# EAGLE design mainb (EAGLE 6.5.0)
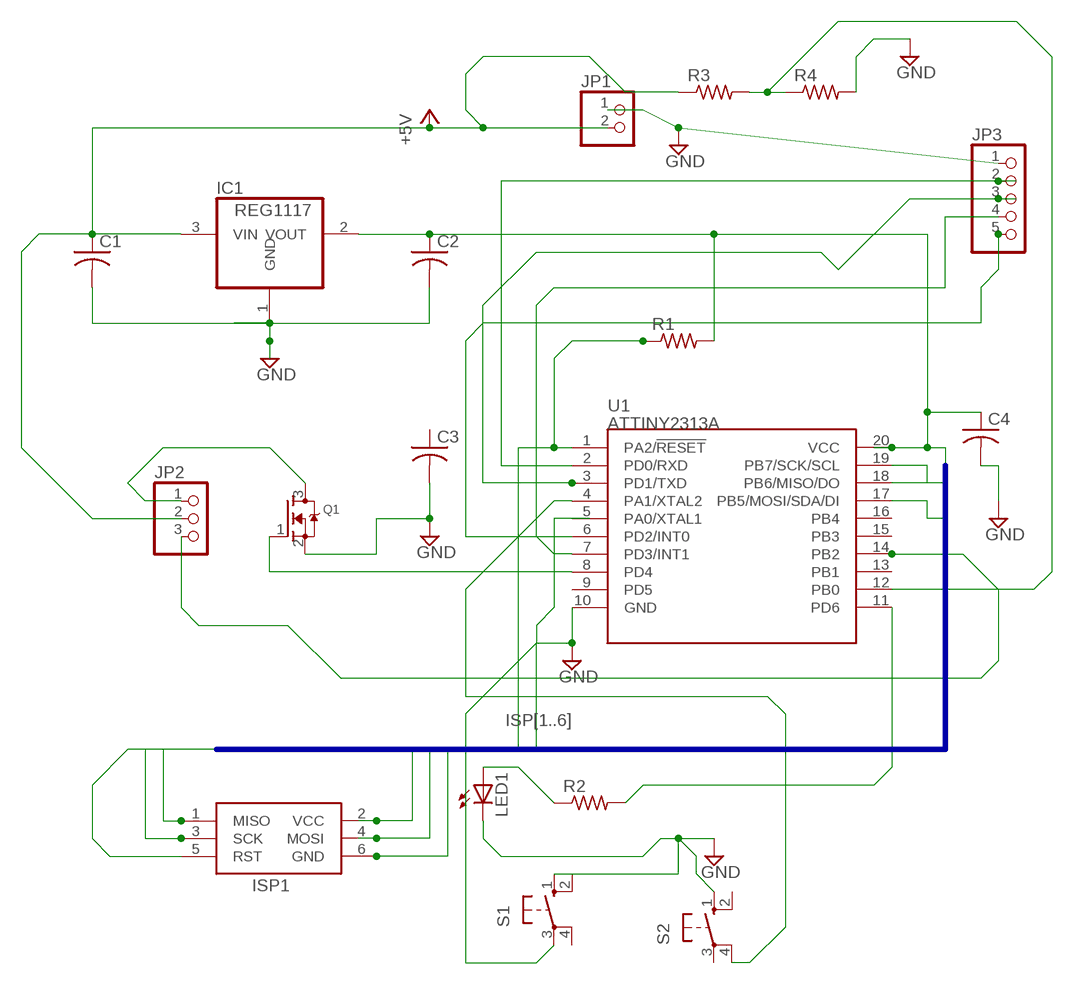
[diagram p0: schematic, sheet 1]

## Parts
C1  C-USC0603  [C0603]
C2  C-USC0603  [C0603]
C3  C-USC0603  [C0603]
C4  C-USC0603  [C0603]
IC1  REG1117  [SOT223]
ISP1  AVRISP-6  [AVRISP]
JP1  PINHD-1X2  [1X02]
JP2  PINHD-1X3  [1X03]
JP3  PINHD-1X5  [1X05]
LED1  LEDSML0603  [SML0603]
Q1  MOSFET-NREFLOW  [SOT23]
R1  R-US_R0603  [R0603]
R2  R-US_R0603  [R0603]
R3  R-US_R0603  [R0603]
R4  R-US_R0603  [R0603]
S1  10-XX  [B3F-10XX]
S2  10-XX  [B3F-10XX]
U1  ATTINY2313A  [SOP20W]

## Nets
+5V: C1.1 IC1.3(VIN) JP1.2 JP2.2 R3.1
GND: C1.2 C2.2 C3.2 C4.2 IC1.1(GND) JP1.1 JP3.1 LED1.C Q1.2(S) R4.2 S1.1(S) S2.1(S)
ISP1: ISP1.1(MISO) U1.18(PB6/MISO/DO)
ISP2: C2.1 C4.1 IC1.2(VOUT) ISP1.2(VCC) R1.2 U1.20(VCC)
ISP3: ISP1.3(SCK) U1.19(PB7/SCK/SCL)
ISP4: ISP1.4(MOSI) U1.17(PB5/MOSI/SDA/DI)
ISP5: ISP1.5(RST) R1.1 U1.1(PA2/!RESET)
ISP6: ISP1.6(GND) U1.10(GND) ; supply symbol labelled GND
N$1: JP2.1 Q1.3(D)
N$3: JP3.3 U1.3(PD1/TXD)
N$4: JP3.2 U1.2(PD0/RXD)
N$5: JP3.4 U1.7(PD3/INT1)
N$6: JP3.5 U1.6(PD2/INT0)
N$7: JP2.3 U1.14(PB2)
N$8: Q1.1(G) U1.8(PD4)
N$10: R3.2 R4.1 U1.12(PB0)
N$11: R2.2 U1.11(PD6)
N$12: LED1.A R2.1
N$13: S1.3(P) U1.5(PA0/XTAL1)
N$14: S2.4(P1) U1.4(PA1/XTAL2)
Unconnected: C3.1 S1.2(S1) S1.4(P1) S2.2(S1) S2.3(P) U1.9(PD5) U1.13(PB1) U1.15(PB3) U1.16(PB4)

## Buses
ISP[1..6]

## Library data of the parts
C1-C4 = adafruit:C-US: CAPACITOR, American symbol
IC1 = burr-brown:REG1117: 800mA and 1A Low Dropout (LDO) Positive Regulator 1.8V, 2.5V, 2.85V, 3.3V, 5V, and Adj; MPN: REG1117; OC_FARNELL: 1097566; OC_NEWARK: 14P6981
ISP1 = adafruit:AVRISP: AVR ISP HEADER Standard 6 pin header for AVR programming
JP1 = pinhead:PINHD-1X2: PIN HEADER
JP2 = adafruit:PINHD-1X3: PIN HEADER
JP3 = pinhead:PINHD-1X5: PIN HEADER
LED1 = led:LED: LED OSRAM: - CHIPLED LG R971, LG N971, LY N971, LG Q971, LY Q971, LO R971, LY R971 LH N974, LH R974 LS Q976, LO Q976, LY Q976 LO Q996 - Hyper CHIPLED LW Q18S LB Q993, LB Q99A, LB R99A - SideLED LS A670, LO A670, LY A670, LG A670, LP A670 LB A673, LV A673, LT A673, LW A673 LH A674 LY A675 LS A676, LA A676, LO A676, LY A676, LW A676 LS A679, LY A679, LG A679 - Hyper Micro SIDELED® LS Y876, LA Y876, LO Y876, LY Y876 LT Y87S - SmartLED LW L88C, LW L88S LB L89C, LB L89S, LG L890 LS L89K, LO L89K, LY L89K LS L896, LA L896, LO L896, LY L896 - TOPLED LS T670, LO T670, LY T670, LG T670, LP T670 LSG T670, LSP T670, LSY T670, LOP T670, LYG T670 LG T671, LOG T671, LSG T671 LB T673, LV T673, LT T673, LW T673 LH T674 LS T676, LA T676, LO T676, LY T676, LB T676, LH T676, LSB T676, LW T676 LB T67C, LV T67C, LT T67C, LS T67K, LO T67K, LY T67K, LW E67C LS E67B, LA E67B, LO E67B, LY E67B, LB E67C, LV E67C, LT E67C LW T67C LS T679, LY T679, LG T679 LS T770, LO T770, LY T770, LG T770, LP T770 LB T773, LV T773, LT T773, LW T773 LH T774 LS E675, LA E675, LY E675, LS T675 LS T776, LA T776, LO T776, LY T776, LB T776 LHGB T686 LT T68C, LB T68C - Hyper Mini TOPLED® LB M676 - Mini TOPLED Santana® LG M470 LS M47K, LO M47K, LY M47K Source: http://www.osram.convergy.de LUXEON: - LUMILED® LXK2-PW12-R00, LXK2-PW12-S00, LXK2-PW14-U00, LXK2-PW14-V00 LXK2-PM12-R00, LXK2-PM12-S00, LXK2-PM14-U00 LXK2-PE12-Q00, LXK2-PE12-R00, LXK2-PE12-S00, LXK2-PE14-T00, LXK2-PE14-U00 LXK2-PB12-K00, LXK2-PB12-L00, LXK2-PB12-M00, LXK2-PB14-N00, LXK2-PB14-P00, LXK2-PB14-Q00 LXK2-PR12-L00, LXK2-PR12-M00, LXK2-PR14-Q00, LXK2-PR14-R00 LXK2-PD12-Q00, LXK2-PD12-R00, LXK2-PD12-S00 LXK2-PH12-R00, LXK2-PH12-S00 LXK2-PL12-P00, LXK2-PL12-Q00, LXK2-PL12-R00 Source: www.luxeon.com KINGBRIGHT: KA-3528ASYC Source: www.kingbright.com
Q1 = adafruit:MOSFET-N: N-Channel Mosfet 2N7002E - 60V 260mA SOT23 [Digikey: 2N7002ET1GOSTR-ND] - REEL BSH103 - 30V 850mA SOT23 [Digikey: 568-5013-1-ND]
R1 R2 = resistor:R-US_: RESISTOR, American symbol
R3 R4 = adafruit:R-US_: RESISTOR, American symbol
S1 S2 = switch-omron:10-XX: OMRON SWITCH; MPN: B3F-1000; OC_FARNELL: 176432; OC_NEWARK: 36M3542
U1 = SparkFun-DigitalIC:ATTINY2313A: ATTINY2313A 2kB 20MHz I2C/SPI/UART; PROD_ID: IC-11305

## Board
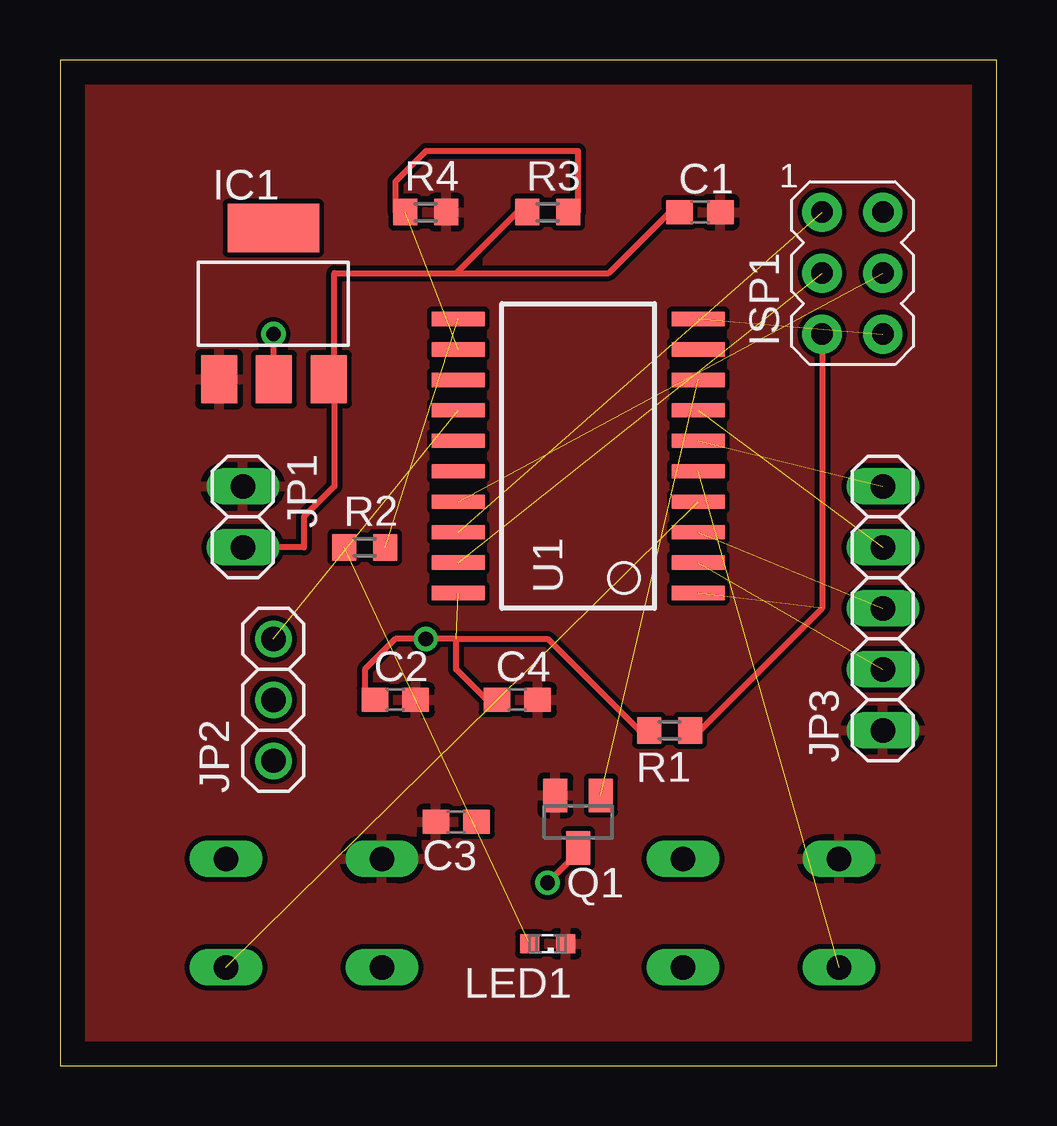
[diagram p1: board, top side]
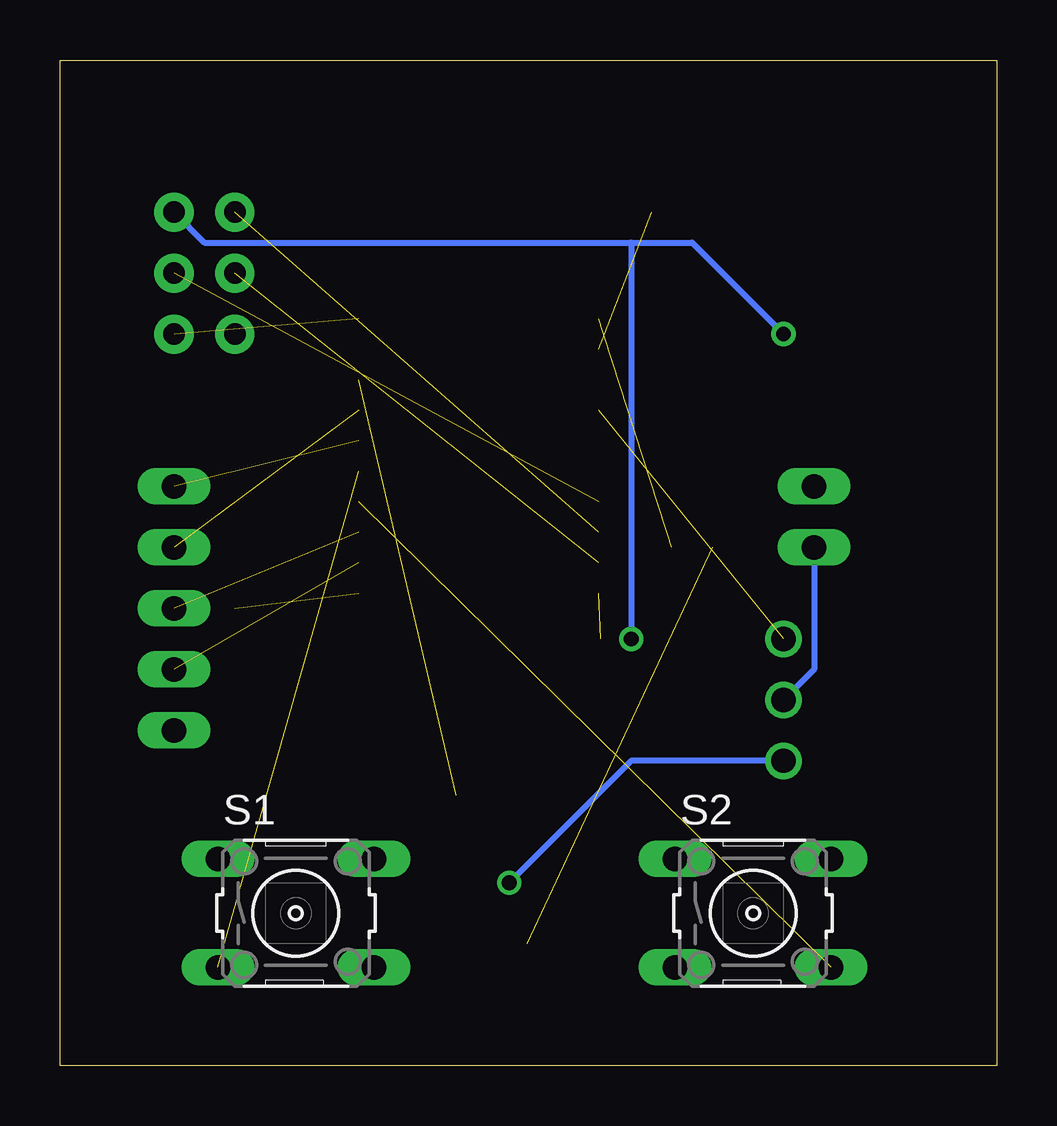
[diagram p2: board, bottom side, seen from below]

Size 39.04 x 41.9 mm. Coordinates in mm from the lower left corner, seen from the top.
Outline: 0,0 39.04,0 39.04,41.9 0,41.9 0,0
Copper layers (1*16): Top 0.035mm / dielectric 1.5mm / Bottom 0.035mm
Design rules "default": minimum track width 10mil, minimum drill 24mil, track to track 8mil, track to pad 8mil, pad to pad 8mil, via to via 8mil, smd to smd 8mil, copper to edge 40mil, drill to drill 8mil, minimum pad ring 10mil, minimum via ring 8mil, stop-mask expansion 4mil, vias tented up to drill 0mil, thermal gap 10mil

### Footprints (pad centres in the part's own frame; a part is rotated, then mirrored left to right if it is on the bottom)
C0603 = smd 1.1 x 1: 1 -0.85,0; 2 0.85,0
SOT223 = smd 1.499 x 2.007: 1 -2.261,-3.15; 2 0.025,-3.15; 3 2.311,-3.15 | smd 3.81 x 2.007: 4 0,3.15
AVRISP = drill 0.9 pad 1.626: 1 -1.27,2.54; 2 1.27,2.54; 3 -1.27,0; 4 1.27,0; 5 -1.27,-2.54; 6 1.27,-2.54
1X02 = drill 1.016 long: 1 -1.27,0; 2 1.27,0
1X03 = drill 1.016: 1 -2.54,0; 2 0,0; 3 2.54,0
1X05 = drill 1.016 long: 1 -5.08,0; 2 -2.54,0; 3 0,0; 4 2.54,0; 5 5.08,0
SML0603 = smd 0.8 x 0.8: A 0.75,0; C -0.75,0
SOT23 = smd 1 x 1.4: 1 -0.95,-1.1; 2 0.95,-1.1; 3 0,1.1
R0603 = smd 1 x 1.1: 1 -0.85,0; 2 0.85,0
B3F-10XX = drill 1.016 long: 1 -3.251,2.261; 2 3.251,2.261; 3 -3.251,-2.261; 4 3.251,-2.261
SOP20W = smd 0.6 x 2.2: 1 -5.715,-5; 2 -4.445,-5; 3 -3.175,-5; 4 -1.905,-5; 5 -0.635,-5; 6 0.635,-5; 7 1.905,-5; 8 3.175,-5; 9 4.445,-5; 10 5.715,-5; 11 5.715,5; 12 4.445,5; 13 3.175,5; 14 1.905,5; 15 0.635,5; 16 -0.635,5; 17 -1.905,5; 18 -3.175,5; 19 -4.445,5; 20 -5.715,5

### Placement (x,y rotation side)
C1  26.67,35.56 0 top
C2  13.97,15.24 0 top
C3  16.51,10.16 180 top
C4  19.05,15.24 0 top
IC1  8.89,31.75 0 top
ISP1  33.02,33.02 0 top
JP1  7.62,22.86 270 top
JP2  8.89,15.24 90 top
JP3  34.29,19.05 90 top
LED1  20.32,5.08 180 top
Q1  21.59,10.16 180 top
R1  25.4,13.97 180 top
R2  12.7,21.59 0 top
R3  20.32,35.56 0 top
R4  15.24,35.56 0 top
S1  29.21,6.35 0 bottom
S2  10.16,6.35 0 bottom
U1  21.59,25.4 90 top

### Tracks (layer width: path | path; a pad name or v marks a point on that pad's centre or on a via)
+5V
  Top 0.254: 16.51,33.02 19.05,35.56 R3.1 | 16.51,33.02 11.43,33.02 11.43,29.21 IC1.3 11.43,27.94 11.43,24.13 10.16,22.86 10.16,21.59 JP1.2 | 16.51,33.02 22.86,33.02 25.4,35.56 C1.1
  Bottom 0.254: JP2.2 7.62,16.51 JP1.2
GND
  pour Top: -1.27,43.18 40.64,43.18 40.64,40.64 40.64,-1.27 -1.27,-1.27
ISP1  (1 unrouted)
ISP2  (via drill 0.61)  (1 unrouted)
  Top 0.254: 16.51,17.78 v15.24,17.78 13.97,17.78 12.7,16.51 12.7,15.24 C2.1 | 16.51,17.78 16.51,16.51 17.78,15.24 C4.1 | 16.51,17.78 20.32,17.78 24.13,13.97 R1.2 | v8.89,30.48 8.89,29.21 IC1.2
  Bottom 0.254: v8.89,30.48 12.7,34.29 15.24,34.29 | 15.24,34.29 33.02,34.29 ISP1.2 | 15.24,34.29 v15.24,17.78
ISP3  (1 unrouted)
ISP4  (1 unrouted)
ISP5  (1 unrouted)
  Top 0.254: ISP1.5 31.75,19.05 26.67,13.97 R1.1
ISP6  (1 unrouted)
N$1  (via drill 0.61)
  Top 0.254: v20.32,7.62 21.59,8.89 Q1.3
  Bottom 0.254: v20.32,7.62 15.24,12.7 JP2.1
N$3  (1 unrouted)
N$4  (1 unrouted)
N$5  (1 unrouted)
N$6  (1 unrouted)
N$7  (1 unrouted)
N$8  (1 unrouted)
N$10  (1 unrouted)
  Top 0.254: R4.1 13.97,35.56 13.97,36.83 15.24,38.1 21.59,38.1 21.59,35.56 R3.2
N$11  (1 unrouted)
N$12  (1 unrouted)
N$13  (1 unrouted)
N$14  (1 unrouted)